# Altium project UZ_A_MAX11331.PrjPCB (part 1 of 3)
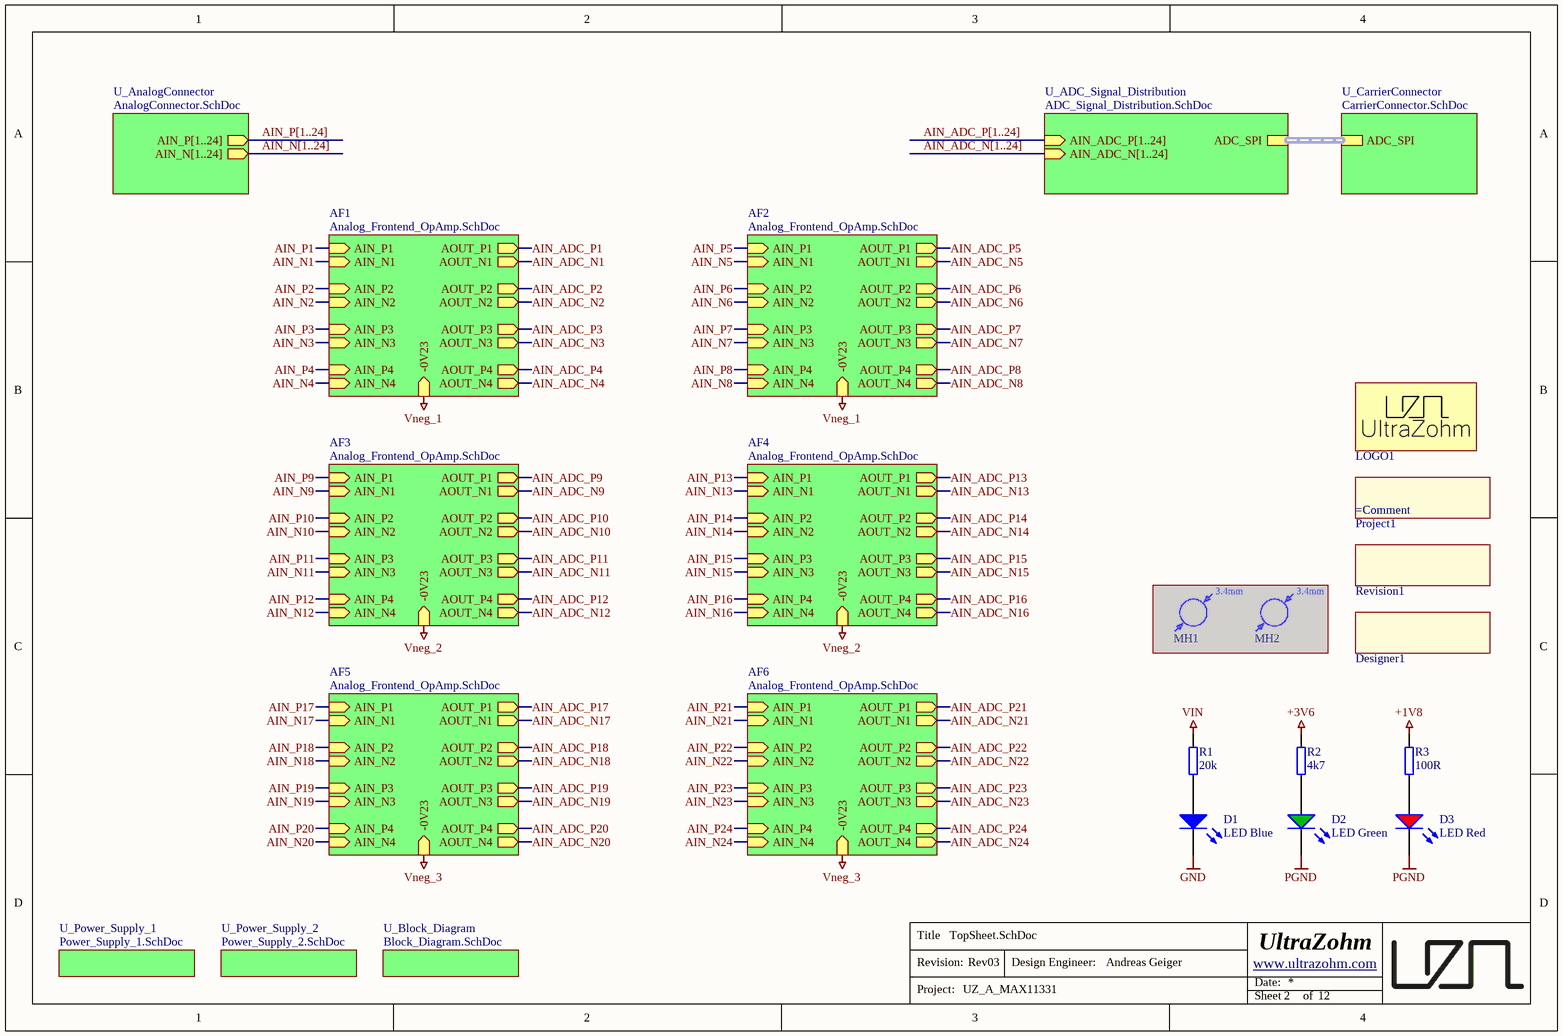
[diagram p0: TopSheet.SchDoc]
Author: Andreas Geiger; AuthorParam: Andreas Geiger; Date: 10/2025; ProjectName: UZ_A_MAX11331; ProjectNameCustom: =ProjectName; ProjectRevision: Rev03
12 sheets, 866 parts. Net scope: hierarchical (ports join the sheet entries above them; power ports are global).
Board file: UZ_A_MAX11331.PcbDoc
Sheets:
  TopSheet.SchDoc
    U_CarrierConnector = CarrierConnector.SchDoc
    U_AnalogConnector = AnalogConnector.SchDoc
    AF1 = Analog_Frontend_OpAmp.SchDoc
      BOA1 = BufferOpAmp.SchDoc
      BOA2 = BufferOpAmp.SchDoc
      BOA3 = BufferOpAmp.SchDoc
      BOA4 = BufferOpAmp.SchDoc
      CDMF1 = CM_DM_Filter.SchDoc
      CDMF2 = CM_DM_Filter.SchDoc
      CDMF3 = CM_DM_Filter.SchDoc
      CDMF4 = CM_DM_Filter.SchDoc
    U_Block_Diagram = Block_Diagram.SchDoc
    U_Power_Supply_1 = Power_Supply_1.SchDoc
    U_ADC_Signal_Distribution = ADC_Signal_Distribution.SchDoc
      ADC1 = Multiplexed_ADC.SchDoc
      ADC2 = Multiplexed_ADC.SchDoc
      ADC3 = Multiplexed_ADC.SchDoc
    AF2 = Analog_Frontend_OpAmp.SchDoc
      BOA1 = BufferOpAmp.SchDoc
      BOA2 = BufferOpAmp.SchDoc
      BOA3 = BufferOpAmp.SchDoc
      BOA4 = BufferOpAmp.SchDoc
      CDMF1 = CM_DM_Filter.SchDoc
      CDMF2 = CM_DM_Filter.SchDoc
      CDMF3 = CM_DM_Filter.SchDoc
      CDMF4 = CM_DM_Filter.SchDoc
    AF3 = Analog_Frontend_OpAmp.SchDoc
      BOA1 = BufferOpAmp.SchDoc
      BOA2 = BufferOpAmp.SchDoc
      BOA3 = BufferOpAmp.SchDoc
      BOA4 = BufferOpAmp.SchDoc
      CDMF1 = CM_DM_Filter.SchDoc
      CDMF2 = CM_DM_Filter.SchDoc
      CDMF3 = CM_DM_Filter.SchDoc
      CDMF4 = CM_DM_Filter.SchDoc
    AF4 = Analog_Frontend_OpAmp.SchDoc
      BOA1 = BufferOpAmp.SchDoc
      BOA2 = BufferOpAmp.SchDoc
      BOA3 = BufferOpAmp.SchDoc
      BOA4 = BufferOpAmp.SchDoc
      CDMF1 = CM_DM_Filter.SchDoc
      CDMF2 = CM_DM_Filter.SchDoc
      CDMF3 = CM_DM_Filter.SchDoc
      CDMF4 = CM_DM_Filter.SchDoc
    AF5 = Analog_Frontend_OpAmp.SchDoc
      BOA1 = BufferOpAmp.SchDoc
      BOA2 = BufferOpAmp.SchDoc
      BOA3 = BufferOpAmp.SchDoc
      BOA4 = BufferOpAmp.SchDoc
      CDMF1 = CM_DM_Filter.SchDoc
      CDMF2 = CM_DM_Filter.SchDoc
      CDMF3 = CM_DM_Filter.SchDoc
      CDMF4 = CM_DM_Filter.SchDoc
    AF6 = Analog_Frontend_OpAmp.SchDoc
      BOA1 = BufferOpAmp.SchDoc
      BOA2 = BufferOpAmp.SchDoc
      BOA3 = BufferOpAmp.SchDoc
      BOA4 = BufferOpAmp.SchDoc
      CDMF1 = CM_DM_Filter.SchDoc
      CDMF2 = CM_DM_Filter.SchDoc
      CDMF3 = CM_DM_Filter.SchDoc
      CDMF4 = CM_DM_Filter.SchDoc
    U_Power_Supply_2 = Power_Supply_2.SchDoc
      Vneg_1 = Power_Supply_3.SchDoc
      Vneg_2 = Power_Supply_3.SchDoc
      Vneg_3 = Power_Supply_3.SchDoc

## Sheet TopSheet.SchDoc
size A4; Author: Andreas Geiger; CompanyName: Technische Hochschule Nürnberg Georg Simon Ohm; Organization: UltraZohm; Address1: Kesslerplatz 12; Address2: 90489 Nürnberg; Address3: GERMANY; DocumentNumber: 2; SheetNumber: 2; SheetTotal: 12; Website: www.ultrazohm.com

### Parts
D1  LED Blue  [WL-SMCW_0603]
D2  LED Green  [WL-SMCW_0603]
D3  LED Red  [WL-SMCW_0603]
Designer1  (no value)  [Designator:comment]  (no BOM)
LOGO1  UZ Logo  [UZ_Logo_small]  (value not drawn)  (no BOM)
MH1  mounting hole 3,4mm  [MH_3.4]  (value not drawn)  (masked out: inside a compile mask, not in the netlist)
MH2  mounting hole 3,4mm  [MH_3.4]  (value not drawn)  (masked out: inside a compile mask, not in the netlist)
Project1  (no value)  [COMMENT]  (no BOM)
R1  20k  [RES 0603_1608]
R2  4k7  [R_0603_TE]
R3  100R  [RES 0603_1608]
Revision1  (no value)  [Designator:comment]  (no BOM)

### Sub-sheets
AF1 = Analog_Frontend_OpAmp.SchDoc: AIN_P1 (in), AIN_N1 (in), AOUT_P1 (out), AOUT_N1 (out), AIN_P2 (in), AIN_N2 (in), AIN_P3 (in), AIN_N3 (in), AIN_P4 (in), AIN_N4 (in), AOUT_P2 (out), AOUT_N2 (out), AOUT_P3 (out), AOUT_N3 (out), AOUT_P4 (out), AOUT_N4 (out), -0V23 (in)
AF2 = Analog_Frontend_OpAmp.SchDoc: AIN_P1 (in), AIN_N1 (in), AOUT_P1 (out), AOUT_N1 (out), AIN_P2 (in), AIN_N2 (in), AIN_P3 (in), AIN_N3 (in), AIN_P4 (in), AIN_N4 (in), AOUT_P2 (out), AOUT_N2 (out), AOUT_P3 (out), AOUT_N3 (out), AOUT_P4 (out), AOUT_N4 (out), -0V23 (in)
AF3 = Analog_Frontend_OpAmp.SchDoc: AIN_P1 (in), AIN_N1 (in), AOUT_P1 (out), AOUT_N1 (out), AIN_P2 (in), AIN_N2 (in), AIN_P3 (in), AIN_N3 (in), AIN_P4 (in), AIN_N4 (in), AOUT_P2 (out), AOUT_N2 (out), AOUT_P3 (out), AOUT_N3 (out), AOUT_P4 (out), AOUT_N4 (out), -0V23 (in)
AF4 = Analog_Frontend_OpAmp.SchDoc: AIN_P1 (in), AIN_N1 (in), AOUT_P1 (out), AOUT_N1 (out), AIN_P2 (in), AIN_N2 (in), AIN_P3 (in), AIN_N3 (in), AIN_P4 (in), AIN_N4 (in), AOUT_P2 (out), AOUT_N2 (out), AOUT_P3 (out), AOUT_N3 (out), AOUT_P4 (out), AOUT_N4 (out), -0V23 (in)
AF5 = Analog_Frontend_OpAmp.SchDoc: AIN_P1 (in), AIN_N1 (in), AOUT_P1 (out), AOUT_N1 (out), AIN_P2 (in), AIN_N2 (in), AIN_P3 (in), AIN_N3 (in), AIN_P4 (in), AIN_N4 (in), AOUT_P2 (out), AOUT_N2 (out), AOUT_P3 (out), AOUT_N3 (out), AOUT_P4 (out), AOUT_N4 (out), -0V23 (in)
AF6 = Analog_Frontend_OpAmp.SchDoc: AIN_P1 (in), AIN_N1 (in), AOUT_P1 (out), AOUT_N1 (out), AIN_P2 (in), AIN_N2 (in), AIN_P3 (in), AIN_N3 (in), AIN_P4 (in), AIN_N4 (in), AOUT_P2 (out), AOUT_N2 (out), AOUT_P3 (out), AOUT_N3 (out), AOUT_P4 (out), AOUT_N4 (out), -0V23 (in)
U_ADC_Signal_Distribution = ADC_Signal_Distribution.SchDoc: AIN_ADC_P[1..24] (in), AIN_ADC_N[1..24] (in), ADC_SPI (harness ADC_SPI)
U_AnalogConnector = AnalogConnector.SchDoc: AIN_P[1..24] (out), AIN_N[1..24] (out)
U_Block_Diagram = Block_Diagram.SchDoc: no entries
U_CarrierConnector = CarrierConnector.SchDoc: ADC_SPI (harness ADC_SPI)
U_Power_Supply_1 = Power_Supply_1.SchDoc: no entries
U_Power_Supply_2 = Power_Supply_2.SchDoc: no entries

### Nets
+1V8: R3.2
+3V6: R2.2
GND: D1.1(K)
PGND: D2.1(K) D3.1(K)
VIN: R1.2
Vneg_1: sheet AF1/-0V23, sheet AF2/-0V23
Vneg_2: sheet AF3/-0V23, sheet AF4/-0V23
Vneg_3: sheet AF5/-0V23, sheet AF6/-0V23
NetD1_2: D1.2(A) R1.1
NetD2_2: D2.2(A) R2.1
NetD3_2: D3.2(A) R3.1

### Buses and harness runs
bus AIN_ADC_N[1..24] = sheet U_ADC_Signal_Distribution/AIN_ADC_N[1..24]
bus AIN_ADC_P[1..24] = sheet U_ADC_Signal_Distribution/AIN_ADC_P[1..24]
bus AIN_N[1..24] = sheet U_AnalogConnector/AIN_N[1..24]
bus AIN_P[1..24] = sheet U_AnalogConnector/AIN_P[1..24]
harness sheet U_ADC_Signal_Distribution/ADC_SPI = sheet U_CarrierConnector/ADC_SPI

### Notes on the sheet
- Title
- Revision:
- Design Engineer:
- Date:
- Project:
- Sheet
- of
- (in symbol Mounting Hole) 3.4mm

### Library data of the parts
D1 = 19-217/BHC-ZL1M2RY/3T: LED BLUE 465~475NM 11.5~28.5MCD@5MA TOP VIEW 0603 ROHS; Manufacturer: Everlight Elec; Type: Standard; Created from: T. Wendt; Forward Current I_f: 20 mA; Forward Voltage U_f: 2.8 V; Wavelength: 470 nm; Nominal Power: 68 mW; Manufacturer Part Number: 19-217/BHC-ZL1M2RY/3T; PartID: 6; Created On: 03.03.2021 09:59:51; ComponentLink1Description: Datasheet; ComponentLink1URL: https://datasheet.lcsc.com/szlcsc/Everlight-Elec-19-217-BHC-ZL1M2RY-3T_C72041.pdf; Component Type: LED Diode; Device Package: 0603; Last Updated: 04.03.2021 09:02:49; Mounting Type: SMD; Operating Temperature: -40 - 85 °C; Supplier 1: LCSC; Supplier Part Number 1: C72041; Live Cycle Status: 1; Stock number: not stored; Color: blue; Light Intensity: 28.5 mcd; LCSC Part Number: C72041
D2 = 19-217/GHC-YR1S2/3T: LED GREEN 520~535NM 112~258MCD@20MA TOP VIEW 0603 ROHS; Manufacturer: Everlight Elec; Type: Standard; Created from: T. Wendt; Forward Current I_f: 20 mA; Forward Voltage U_f: 3.3 V; Wavelength: 530 nm; Light Intensity: 285 mcd; Nominal Power: 83 mW; Manufacturer Part Number: 19-217/GHC-YR1S2/3T; PartID: 7; Created On: 03.03.2021 10:06:23; ComponentLink1Description: Datasheet; ComponentLink1URL: https://datasheet.lcsc.com/szlcsc/Everlight-Elec-19-217-GHC-YR1S2-3T_C72043.pdf; Component Type: LED Diode; Device Package: 0603; Last Updated: 04.03.2021 09:02:49; Mounting Type: SMD; Operating Temperature: -40 - 85 °C; Supplier 1: LCSC; Supplier Part Number 1: C72043; Supplier 2: Mouser; Supplier Part Number 2: 638-19217GHCYR1S23T; Live Cycle Status: 1; Stock number: not stored; Color: green; LCSC Part Number: C72043
D3 = KT-0603R: LED RED 520~625NM 90~100MCD@20MA TOP VIEW 0603 ROHS; Manufacturer: Hubei KENTO Elec; Type: Standard; Created from: T. Wendt; Forward Current I_f: 20 mA; Forward Voltage U_f: 2.1 V; Wavelength: 620 nm; Light Intensity: 110 mcd; Nominal Power: 42 mW; Manufacturer Part Number: KT-0603R; PartID: 8; Created On: 03.03.2021 10:06:23; ComponentLink1Description: Datasheet; ComponentLink1URL: https://datasheet.lcsc.com/szlcsc/Hubei-KENTO-Elec-KT-0603R_C2286.pdf; Component Type: LED Diode; Device Package: 0603; Last Updated: 04.03.2021 09:02:49; Mounting Type: SMD; Operating Temperature: -40 - 85 °C; Supplier 1: LCSC; Supplier Part Number 1: C2286; Live Cycle Status: 1; Stock number: not stored; Color: red; LCSC Part Number: C2286
Designer1 = 4: Create a project parameter named "Author" this is the value of this component. It is printed on the PCB. Once the parameter is updated (e.g. new revision) it gets updated on the PCB as well; Manufacturer: PCB Manufacturer; Manufacturer Part Number: Project Author; Value: Andreas Geiger; Created from: T. Wendt; PartID: 4; Created On: 01.03.2021 08:53:41; Component Type: Project Author; Last Updated: 01.03.2021 09:20:27; Type: Standard (No BOM); Live Cycle Status: 1
LOGO1 = 1: Official Project Logo of the UltraZohm; Manufacturer: PCB Manufacturer; Manufacturer Part Number: UltraZohm Logo; Created from: T. Wendt; PartID: 1; Created On: 19.02.2021 16:55:56; ComponentLink1Description: Homepage; ComponentLink1URL: https://ultrazohm.com; Component Type: Logo; Last Updated: 02.03.2021 14:31:24; Type: Standard (No BOM); Live Cycle Status: 1
MH1 MH2 = Mounting Hole: Non plated through hole, 3.4mm
Project1 = 2: Create a project parameter named "ProjectNameCustom" this is the value of this component and it is printed on the PCB.; Manufacturer: PCB Manufacturer; Created from: T. Wendt; PartID: 2; Created On: 01.03.2021 08:43:57; Component Type: Project Name; Last Updated: 01.03.2021 09:07:27; Manufacturer Part Number: Project Name; Type: Standard (No BOM); Value: =ProjectName; Live Cycle Status: 1
R1 = 0603WAF2002T5E: SMD resistor E24 series; Manufacturer: UNI-ROYAL; Tolerance: 1%; Created from: AGeiger; Manufacturer Part Number: 0603WAF2002T5E; PartID: 105; Created On: 14.12.2020 16:17:14; ComponentLink1Description: Datasheet; ComponentLink1URL: https://datasheet.lcsc.com/lcsc/2206010230_UNI-ROYAL-Uniroyal-Elec-0603WAF2002T5E_C4184.pdf; Component Type: SMD resistor; Device Package: 0603; Last Updated: 25.08.2022 20:05:50; Mounting Type: SMD; Supplier 1: LCSC; Supplier Part Number 1: C4184; Type: Resistor; Value: 20k; Live Cycle Status: 1; Stock number: Labor SMD Container; LCSC Part Number: C4184
R2 = UZgen_R_0603_4k7: Generic resistor; Manufacturer: UZgen; Tolerance: 1 %; Created from: UZgenTool; Manufacturer Part Number: UZgen_R_0603_4k7; PartID: 237; Created On: 02.07.2024 17:29:50; Device Package: 0603; Last Updated: 02.07.2024 17:29:50; Mounting Type: SMD; Value: 4k7
R3 = RK73B1JTTD101J: SMD resistor E24 series; Manufacturer: KOA Speer; Tolerance: 5%; Created from: MGremer; Manufacturer Part Number: RK73B1JTTD101J; PartID: 50; Created On: 14.12.2020 16:17:14; ComponentLink1Description: Datasheet; ComponentLink1URL: https://www.mouser.de/datasheet/2/219/RK73B-1825463.pdf; Component Type: SMD resistor; Device Package: 0603; Last Updated: 29.11.2022 14:30:07; Mounting Type: SMD; Supplier 1: Mouser; Supplier Part Number 1: 660-RK73B1JTTD101J; Type: Resistor; Value: 100R; Live Cycle Status: 1; Stock number: Labor SMD Container; LCSC Part Number: C22775; Supplier 2: LCSC; Supplier Part Number 2: C22775
Revision1 = 3: Create a project parameter named "ProjectRevision" this is the value of this component. It is printed on the PCB. Once the parameter is updated (e.g. new revision) it gets updated on the PCB as well; Manufacturer: PCB Manufacturer; Value: Rev03; Created from: T. Wendt; PartID: 3; Created On: 01.03.2021 08:50:34; Component Type: Project Revision; Last Updated: 01.03.2021 09:28:36; Manufacturer Part Number: Project Revision; Type: Standard (No BOM); Live Cycle Status: 1

## Sheet CarrierConnector.SchDoc
size A4; Author: Andreas Geiger; CompanyName: Technische Hochschule Nürnberg Georg Simon Ohm; Organization: UltraZohm; Address1: Kesslerplatz 12; Address2: 90489 Nürnberg; Address3: GERMANY; DocumentNumber: 3; SheetNumber: 3; SheetTotal: 12; Website: www.ultrazohm.com
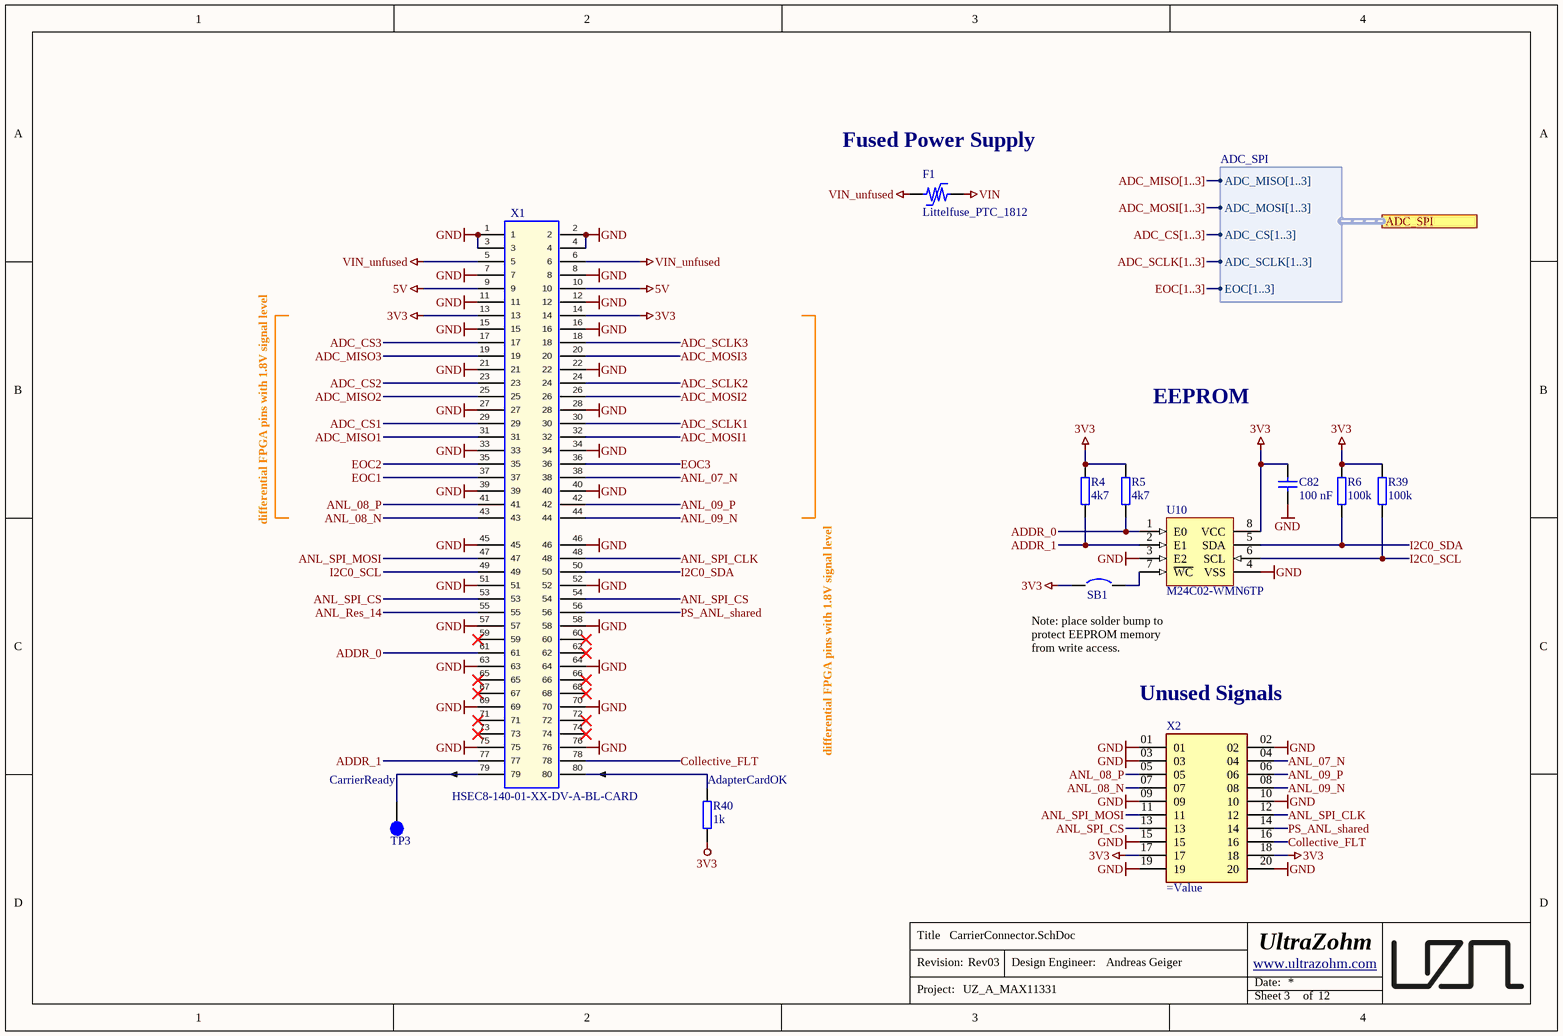
[diagram p1: CarrierConnector.SchDoc]

### Parts
C82  100 nF  [C_0603_TE]
F1  Littelfuse_PTC_1812  [1812_PTC_Polyfuse_Littelfuse]
R4  4k7  [R_0603_TE]
R5  4k7  [R_0603_TE]
R6  100k  [R_0603_TE]
R39  100k  [R_0603_TE]
R40  1k  [R_0603_TE]
SB1  Solder Bump 0603  [SB_0603]  (value not drawn)  (no BOM)
TP3  Testpoint 1mm  [TP_1mm]  (value not drawn)  (no BOM)
U10  M24C02-WMN6TP  [D0008A_N]
X1  HSEC8-140-01-XX-DV-A-BL-CARD  [HSEC8-140-01-XX-DV-A-BL-CARD]  (no BOM)
X2  (no value)  [SAMTEC_FTSH-110-X-X-DV]

### Ports
ADC_SPI (harness ADC_SPI)

### Harnesses
ADC_SPI: ADC_MISO[1..3], ADC_MOSI[1..3], ADC_CS[1..3], ADC_SCLK[1..3], EOC[1..3]

### Nets
3V3: C82.1 R4.2 R5.2 R6.2 R39.2 R40.1 SB1.1 U10.8(VCC) X1.13 X1.14 X2.17 X2.18
5V: X1.9 X1.10
GND: C82.2 U10.3(E2) U10.4(VSS) X1.1 X1.2 X1.3 X1.4 X1.7 X1.8 X1.11 X1.12 X1.15 X1.16 X1.21 X1.22 X1.27 X1.28 X1.33 X1.34 X1.39 X1.40 X1.45 X1.46 X1.51 X1.52 X1.57 X1.58 X1.63 X1.64 X1.69 X1.70 X1.75 X1.76 X2.01 X2.02 X2.03 X2.09 X2.10 X2.15 X2.19 X2.20
VIN: F1.2
VIN_unfused: F1.1 X1.5 X1.6
ADC_CS1: X1.29
ADC_CS2: X1.23
ADC_CS3: X1.17
ADC_MISO1: X1.31
ADC_MISO2: X1.25
ADC_MISO3: X1.19
ADC_MOSI1: X1.32
ADC_MOSI2: X1.26
ADC_MOSI3: X1.20
ADC_SCLK1: X1.30
ADC_SCLK2: X1.24
ADC_SCLK3: X1.18
ADDR_0: R5.1 U10.1(E0) X1.61
ADDR_1: R4.1 U10.2(E1) X1.77
ANL_07_N: X1.38 X2.04
ANL_08_N: X1.43 X2.07
ANL_08_P: X1.41 X2.05
ANL_09_N: X1.44 X2.08
ANL_09_P: X1.42 X2.06
ANL_Res_14: X1.55
ANL_SPI_CLK: X1.48 X2.12
ANL_SPI_CS: X1.53 X1.54 X2.13
ANL_SPI_MOSI: X1.47 X2.11
Collective_FLT: X1.78 X2.16
EOC1: X1.37
EOC2: X1.35
EOC3: X1.36
I2C0_SCL: R39.1 U10.6(SCL) X1.49
I2C0_SDA: R6.1 U10.5(SDA) X1.50
PS_ANL_shared: X1.56 X2.14
NetR40_2: R40.2 X1.80
NetSB1_2: SB1.2 U10.7(~{WC})
NetTP3_1: TP3.1 X1.79

Not connected (* = marked no-connect by the designer): X1 59* 60* 62* 65* 66* 67* 68* 71* 72* 73* 74*

### Buses and harness runs
bus ADC_CS[1..3]
bus ADC_MISO[1..3]
bus ADC_MOSI[1..3]
bus ADC_SCLK[1..3]
bus EOC[1..3]

### Notes on the sheet
- (near F1) Fused Power Supply
- EEPROM
- differential FPGA pins with 1.8V signal level
- Note: place solder bump to protect EEPROM memory from write access.
- (near X2) Unused Signals
- (near TP3) CarrierReady
- (near R40) AdapterCardOK
- Title
- Revision:
- Design Engineer:
- Date:
- Project:
- Sheet
- of

### Library data of the parts
C82 = UZgen_C_0603_100nF_50V_X7R: Generic capacitor; Manufacturer: UZgen; Tolerance: 10 %; Created from: AGeiger; Voltage: 50V; Manufacturer Part Number: UZgen_C_0603_100nF_50V_X7R; PartID: 1; Created On: 02.07.2024 14:42:23; Device Package: 0603; Last Updated: 08.08.2024 15:01:15; Mounting Type: SMD; Value: 100 nF; Technology: X7R
F1 = Littelfuse_PTC_1812: POLYSWITCH RESETTABLE DEVICES; MPN: miniASMDC110F/24; Value: PTC, 1.1 A, 24V; Voltage: 24V; Trip Current: 2.2A; Hold Current: 1.1A; Resistance: 0.18 Ohm; Type: Fuse; Nominal current: 1 A; Created from: MHlatky; MF: Littelfuse; Created: 2019_02_10_AGeiger; Package: 1812; ComponentLink1URL: https://www.littelfuse.com/~/media/electronics/datasheets/resettable_ptcs/littelfuse_ptc_surface_mount_catalog_datasheet.pdf.pdf; ComponentLink1Description: Datasheet; Manufacturer Part Number: Littelfuse_PTC_1812; PartID: 5; Created On: 07.05.2021 06:50:33; Component Type: Littelfuse_PTC_1812; Last Updated: 27.05.2022 15:06:17; Manufacturer: Littelfuse; Mounting Type: SMD; Operating Temperature: -40 - 85 °C; Supplier 1: Mouser; Supplier Part Number 1: 530-0ZCG0150BF2C; Live Cycle Status: 1; LCSC Part Number: C70119
R4 R5 = UZgen_R_0603_4k7: as R2 on sheet TopSheet; Manufacturer Part Number: UZgen_R_0603_4k7; PartID: 237; Created On: 02.07.2024 17:29:50; Device Package: 0603; Last Updated: 02.07.2024 17:29:50; Mounting Type: SMD; Value: 4k7
R6 R39 = UZgen_R_0603_100k: Generic resistor; Manufacturer: UZgen; Tolerance: 1 %; Created from: UZgenTool; Manufacturer Part Number: UZgen_R_0603_100k; PartID: 268; Created On: 02.07.2024 17:29:50; Device Package: 0603; Last Updated: 02.07.2024 17:29:50; Mounting Type: SMD; Value: 100k
R40 = UZgen_R_0603_1k: Generic resistor; Manufacturer: UZgen; Tolerance: 1 %; Created from: UZgenTool; Manufacturer Part Number: UZgen_R_0603_1k; PartID: 221; Created On: 02.07.2024 17:29:49; Value: 1k; Device Package: 0603; Mounting Type: SMD; Last Updated: 02.07.2024 17:29:49
SB1 = =Value: Created from: AGeiger; Revision: July-2002: Re-released for DXP Platform.; PartID: 1; Created On: 09.01.2024 17:13:56; Component Type: Solder Bump; Device Package: 0603; Last Updated: 09.01.2024 17:13:56; Manufacturer Part Number: Solder Bump 0603; Mounting Type: SMD; Value: Solder Bump 0603
TP3 = Testpoint_1mm: Manufacturer: UltraZohm; Created from: AGeiger; Created: 2018_06_25_AGeiger; Value: Testpoint 1mm; Manufacturer Part Number: Testpoint_1mm; PartID: 9; Created On: 20.09.2022 13:14:57; Component Type: Testpoint; Last Updated: 14.08.2025 11:47:07; Supplier 1: NULL; Supplier Part Number 1: NULL; Type: Testpoint; Live Cycle Status: 1
U10 = M24C02-WMN6TP: 2Kbit I2C SOP-8 EEPROM ROHS; Manufacturer: STMicroelectronics; Created from: AGeiger; Manufacturer Part Number: M24C02-WMN6TP; PartID: 1; Created On: 19.11.2023 14:54:27; ComponentLink1Description: Datasheet; ComponentLink1URL: https://www.st.com/resource/en/datasheet/m24c01-w.pdf; Component Type: EEPROM; Device Package: SOIC-8; Last Updated: 19.11.2023 21:39:04; Mounting Type: SMD; Operating Temperature: -40 to +85 °C; Series: M24xxx; Supplier 1: Mouser; Supplier Part Number 1: 511-M24C02-WMN6TP; Supplier 2: LCSC; Supplier Part Number 2: C7562; Type: Memory; Value: M24C02-WMN6TP; LCSC Part Number: C7562; MF: STMicroelectronics; MPN: M24C02-WMN6TP
X1 = HSEC8-140-01-XX-DV-A-BL-CARD: Mating Card Layout for HSEC8-140-01-XX-DV-A-BL-CARD; Manufacturer: SAMTEC; Created from: MHlatky; Number of positions: 100; Created: 2018_04_23_AGeiger; Value: HSEC8-140-01-XX-DV-A-BL-CARD; Manufacturer Part Number: HSEC8-140-01-XX-DV-A-BL-CARD; PartID: 21; Created On: 26.02.2021 16:36:12; ComponentLink1Description: Homepage; ComponentLink1URL: https://www.samtec.com/products/hsec8-dp; Component Type: Board to Board Connector; Device Package: PCB Shape; Last Updated: 26.02.2021 16:37:20; Mounting Type: PCB Shape; Series: HSEC8; Supplier 1: SAMTEC; Supplier Part Number 1: NA; Type: Board to Board Connector; Live Cycle Status: 1; Stock number: not stored; Number of rows: 2
X2 = FTSH-110-01-L-DV: Headers & Wire Housings High Reliability Header Strips, 0.050 pitch; Manufacturer: SAMTEC; Created from: AGeiger; Price: None; Value: FTSH-110-01-L-DV; Availability: Unavailable; Package: None; MP: FTSH-110-X-X-DV; PartID: 1; Created On: 29.09.2022 16:58:28; ComponentLink1Description: Datasheet; ComponentLink1URL: https://eu.mouser.com/datasheet/2/527/ftsh_th-2854322.pdf; Last Updated: 29.09.2022 16:58:28; Manufacturer Part Number: FTSH-110-01-L-DV; Mounting Type: SMD; Operating Temperature: -55 °C to +125 °C; Series: FTSH; Supplier 1: Mouser; Supplier Part Number 1: 200-FTSH11001LDV

## Sheet AnalogConnector.SchDoc
size A4; Author: Andreas Geiger; CompanyName: Technische Hochschule Nürnberg Georg Simon Ohm; Organization: UltraZohm; Address1: Kesslerplatz 12; Address2: 90489 Nürnberg; Address3: GERMANY; DocumentNumber: 4; SheetNumber: 4; SheetTotal: 12; Website: www.ultrazohm.com
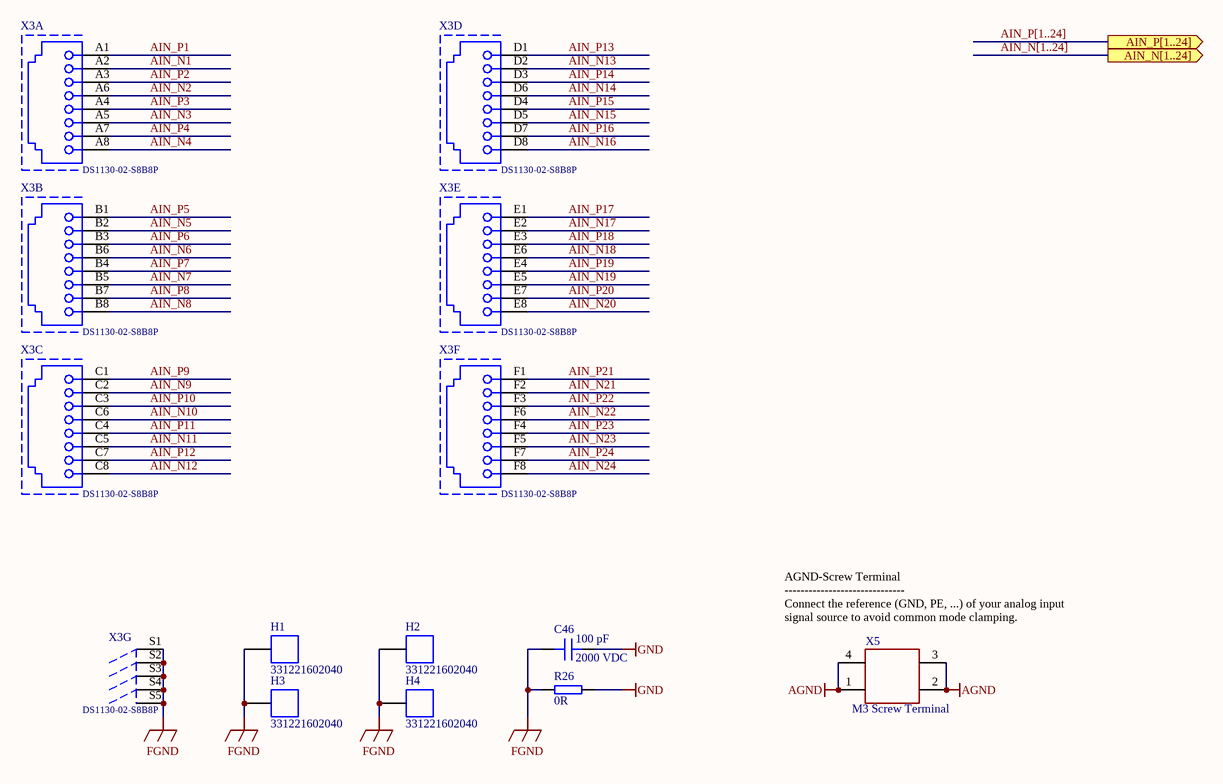
[diagram p2: AnalogConnector.SchDoc]

### Parts
C46  100 pF  Voltage Rating: 2000 VDC  [C_1206]
H1  331221602040  [331221602040]
H2  331221602040  [331221602040]
H3  331221602040  [331221602040]
H4  331221602040  [331221602040]
R26  0R  [R_1206_TE]
X3  DS1130-02-S8B8P  [DS1130-02-S8B8P]  (parts A,B,C,D,E,F,G of 7)
X5  M3 Screw Terminal  [KEYSTONE_7698]

### Ports
AIN_N[1..24] (out), AIN_P[1..24] (out)

### Nets
AGND: X5.1 X5.2 X5.3 X5.4
FGND: C46.1 H1.1 H2.1 H3.1 H4.1 R26.1 X3.S1 X3.S2 X3.S3 X3.S4 X3.S5
GND: C46.2 R26.2
AIN_N1: X3.A2
AIN_N2: X3.A6
AIN_N3: X3.A5
AIN_N4: X3.A8
AIN_N5: X3.B2
AIN_N6: X3.B6
AIN_N7: X3.B5
AIN_N8: X3.B8
AIN_N9: X3.C2
AIN_N10: X3.C6
AIN_N11: X3.C5
AIN_N12: X3.C8
AIN_N13: X3.D2
AIN_N14: X3.D6
AIN_N15: X3.D5
AIN_N16: X3.D8
AIN_N17: X3.E2
AIN_N18: X3.E6
AIN_N19: X3.E5
AIN_N20: X3.E8
AIN_N21: X3.F2
AIN_N22: X3.F6
AIN_N23: X3.F5
AIN_N24: X3.F8
AIN_P1: X3.A1
AIN_P2: X3.A3
AIN_P3: X3.A4
AIN_P4: X3.A7
AIN_P5: X3.B1
AIN_P6: X3.B3
AIN_P7: X3.B4
AIN_P8: X3.B7
AIN_P9: X3.C1
AIN_P10: X3.C3
AIN_P11: X3.C4
AIN_P12: X3.C7
AIN_P13: X3.D1
AIN_P14: X3.D3
AIN_P15: X3.D4
AIN_P16: X3.D7
AIN_P17: X3.E1
AIN_P18: X3.E3
AIN_P19: X3.E4
AIN_P20: X3.E7
AIN_P21: X3.F1
AIN_P22: X3.F3
AIN_P23: X3.F4
AIN_P24: X3.F7

### Buses and harness runs
bus AIN_N[1..24] = port AIN_N[1..24]
bus AIN_P[1..24] = port AIN_P[1..24]

### Notes on the sheet
- (near X5) AGND-Screw Terminal
  ------------------------------
  Connect the reference (GND, PE, ...) of your analog input signal source to avoid common mode clamping.
- Title
- Revision:
- Design Engineer:
- Date:
- Project:
- Sheet
- of

### Library data of the parts
C46 = CC1206JKNPODBN101: 2kV 100pF NP0 ±5% 1206 Multilayer Ceramic Capacitors MLCC - SMD/SMT ROHS; Manufacturer: YAGEO; Created from: AGeiger; Manufacturer Part Number: CC1206JKNPODBN101; PartID: 115; Created On: 02.12.2022 11:59:53; ComponentLink1Description: Datasheet; ComponentLink1URL: https://datasheet.lcsc.com/lcsc/2108131530_YAGEO-CC1206JKNPODBN101_C113876.pdf; Component Type: Capacitor 1206; Device Package: 1206; Last Updated: 02.12.2022 11:59:53; Mounting Type: SMD; Operating Temperature: -55 to +125°C; Series: NP0; Supplier 1: LCSC; Supplier Part Number 1: C113876; Type: Capacitor; Tolerance: 5 %; Value: 100 pF; Live Cycle Status: 1; LCSC Part Number: C113876
H1-H4 = 331221602040: Contact Finger between PCB's earth and housing; Manufacturer: Wuerth Elektronik; Match Code: WE-SECF; Recommended Working Height Min: 5mm; Recommended Working Height Max: 5.7mm; Created from: AGeiger; ComponentLink1Description: Datasheet; ComponentLink1URL: https://redexpert.we-online.com/redexpert/spec/331221602040.pdf; ComponentLink2Description: Datasheet Link; ComponentLink2URL: https://www.we-online.com/redexpert/spec/331221602040?ad; Manufacturer Part Number: 331221602040; Category: EMC Shielding; Mount: Surface Mount; Operating Temperature Max: 100°C; Operating Temperature Min: -40°C; Packaging: Tape and Reel; Length: 6mm; Width: 2mm; Height: 4mm; Material: Copper Beryllium (CuBe) gold-plated(AU); PartID: 18; Created On: 02.12.2022 10:27:54; Component Type: EMI Contact Finger; Last Updated: 02.12.2022 10:27:54; Mounting Type: SMD; Operating Temperature: -40 to +100 °C; Series: SECF; Supplier 1: Mouser; Supplier Part Number 1: 710-331221602040; Type: Contact Finger; Value: 331221602040; Live Cycle Status: 1
R26 = UZgen_R_1206_0R: Generic resistor; Manufacturer: UZgen; Tolerance: 1 %; Created from: UZgenTool; Manufacturer Part Number: UZgen_R_1206_0R; PartID: 583; Created On: 08.07.2024 14:34:30; Device Package: 1206; Last Updated: 08.07.2024 14:34:30; Mounting Type: SMD; Value: 0R
X3 = DS1130-02-S8B8P: RJ45 RJReceptacle 6 No Plugin Ethernet Connectors/Modular Connectors (RJ45 RJ11) ROHS; Manufacturer: CONNFLY Elec; Created from: AGeiger; Manufacturer Part Number: DS1130-02-S8B8P; PartID: 7; Created On: 20.09.2022 09:18:12; ComponentLink1Description: Datasheet; ComponentLink1URL: https://datasheet.lcsc.com/lcsc/1811141116_CONNFLY-Elec-DS1130-02-S8B8P_C86584.pdf; Component Type: RJ45 Connector; Device Package: RJ45; Last Updated: 20.09.2022 09:18:12; Mounting Type: THT; Supplier 1: LCSC; Supplier Part Number 1: C86584; Type: RJ45 Connector; Live Cycle Status: 1; LCSC Part Number: C86584; Stock number: not stored
X5 = Keystone: Tin 15A Brass 4 Through Hole M3x0.5 Screw Connectors ROHS; Created from: AGeiger; Manufacturer Part Number: Keystone; PartID: 5; Created On: 02.10.2025 12:53:47; ComponentLink1Description: Datasheet; ComponentLink1URL: https://www.mouser.de/datasheet/3/201/1/7698.PDF; Component Type: Metric Screw Terminal; Last Updated: 02.10.2025 13:02:36; Mounting Type: THT; Supplier 1: Mouser; Supplier Part Number 1: 534-7698; Supplier 2: LCSC; Supplier Part Number 2: C6708741; Value: M3 Screw Terminal; LCSC Part Number: C6708741

## Sheet Analog_Frontend_OpAmp.SchDoc
size A4; Author: Andreas Geiger; CompanyName: Technische Hochschule Nürnberg Georg Simon Ohm; Organization: UltraZohm; Address1: Kesslerplatz 12; Address2: 90489 Nürnberg; Address3: GERMANY; DocumentNumber: 5; SheetNumber: 5; SheetTotal: 12; Website: www.ultrazohm.com
Used 6 times, as channels AF1, AF2, AF3, AF4, AF5, AF6. Parts and nets are listed once, with the designators drawn on the sheet.
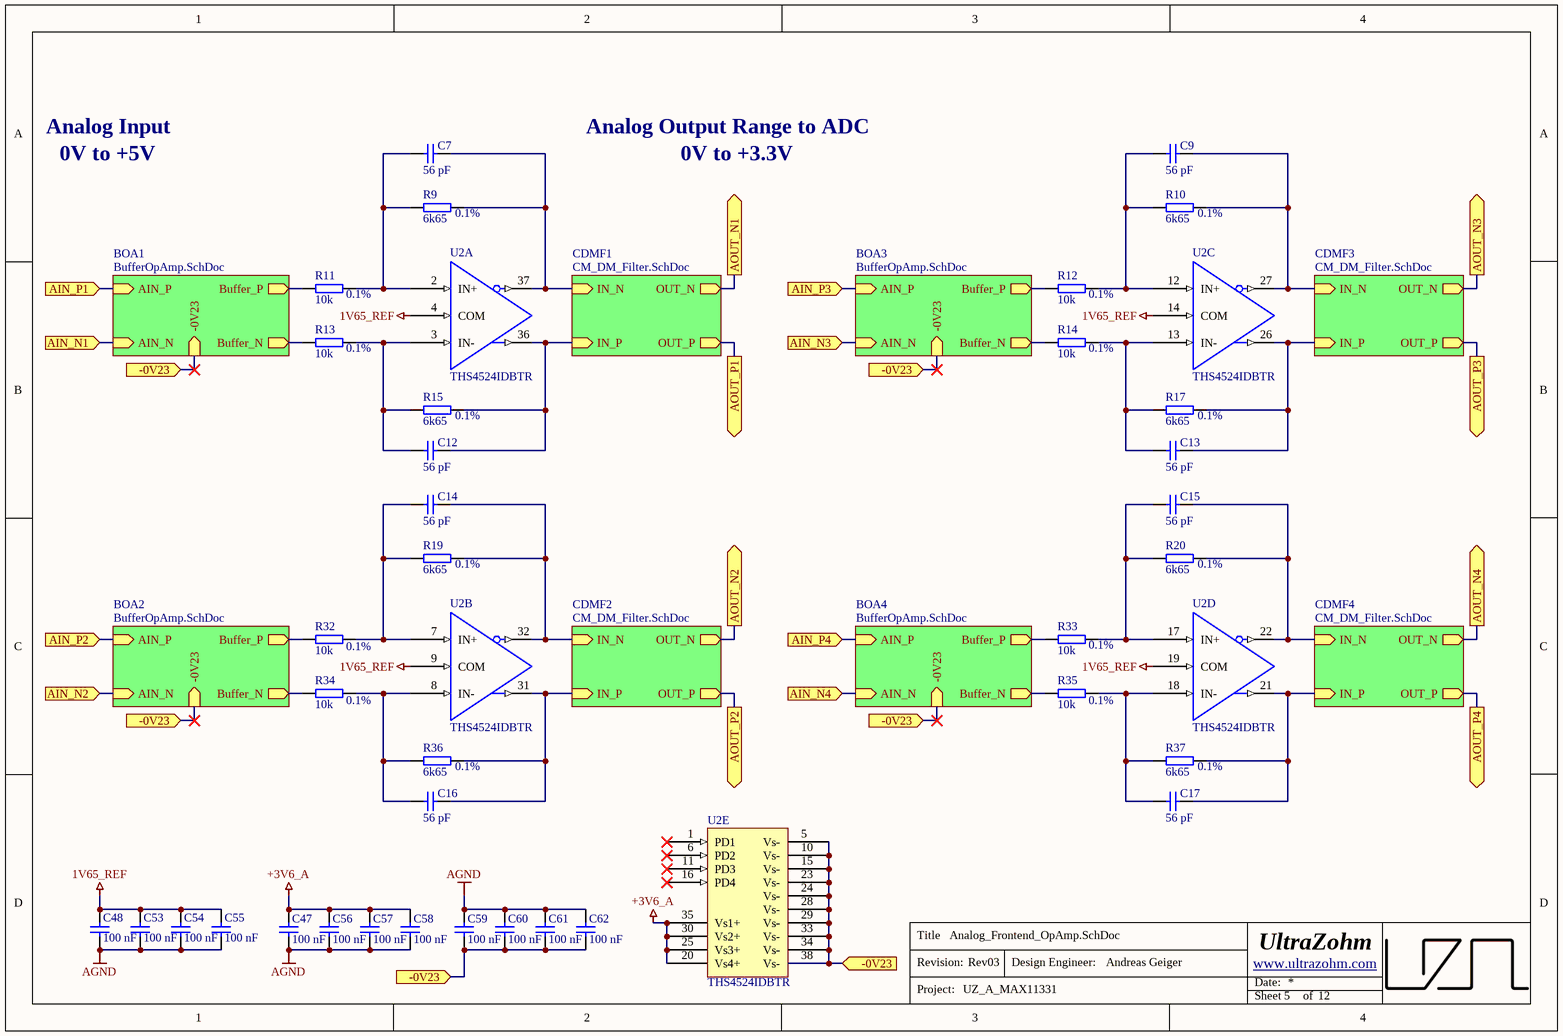
[diagram p3: Analog_Frontend_OpAmp.SchDoc]

### Parts
C7  56 pF  [C_0402_TE]
C9  56 pF  [C_0402_TE]
C12  56 pF  [C_0402_TE]
C13  56 pF  [C_0402_TE]
C14  56 pF  [C_0402_TE]
C15  56 pF  [C_0402_TE]
C16  56 pF  [C_0402_TE]
C17  56 pF  [C_0402_TE]
C47  100 nF  [C_0402_TE]
C48  100 nF  [C_0402_TE]
C53  100 nF  [C_0402_TE]
C54  100 nF  [C_0402_TE]
C55  100 nF  [C_0402_TE]
C56  100 nF  [C_0402_TE]
C57  100 nF  [C_0402_TE]
C58  100 nF  [C_0402_TE]
C59  100 nF  [C_0402_TE]
C60  100 nF  [C_0402_TE]
C61  100 nF  [C_0402_TE]
C62  100 nF  [C_0402_TE]
R9  6k65  Tolerance: 0.1%  [R_0402_TE]
R10  6k65  Tolerance: 0.1%  [R_0402_TE]
R11  10k  Tolerance: 0.1%  [R_0402_TE]
R12  10k  Tolerance: 0.1%  [R_0402_TE]
R13  10k  Tolerance: 0.1%  [R_0402_TE]
R14  10k  Tolerance: 0.1%  [R_0402_TE]
R15  6k65  Tolerance: 0.1%  [R_0402_TE]
R17  6k65  Tolerance: 0.1%  [R_0402_TE]
R19  6k65  Tolerance: 0.1%  [R_0402_TE]
R20  6k65  Tolerance: 0.1%  [R_0402_TE]
R32  10k  Tolerance: 0.1%  [R_0402_TE]
R33  10k  Tolerance: 0.1%  [R_0402_TE]
R34  10k  Tolerance: 0.1%  [R_0402_TE]
R35  10k  Tolerance: 0.1%  [R_0402_TE]
R36  6k65  Tolerance: 0.1%  [R_0402_TE]
R37  6k65  Tolerance: 0.1%  [R_0402_TE]
U2  THS4524IDBTR  [TSSOP-38]  (parts A,B,C,D,E of 5)

### Sub-sheets
BOA1 = BufferOpAmp.SchDoc: Buffer_P (out), Buffer_N (out), AIN_P (in), AIN_N (in), -0V23 (in)
BOA2 = BufferOpAmp.SchDoc: Buffer_P (out), Buffer_N (out), AIN_P (in), AIN_N (in), -0V23 (in)
BOA3 = BufferOpAmp.SchDoc: Buffer_P (out), Buffer_N (out), AIN_P (in), AIN_N (in), -0V23 (in)
BOA4 = BufferOpAmp.SchDoc: Buffer_P (out), Buffer_N (out), AIN_P (in), AIN_N (in), -0V23 (in)
CDMF1 = CM_DM_Filter.SchDoc: IN_P (in), IN_N (in), OUT_P (out), OUT_N (out)
CDMF2 = CM_DM_Filter.SchDoc: IN_P (in), IN_N (in), OUT_P (out), OUT_N (out)
CDMF3 = CM_DM_Filter.SchDoc: IN_P (in), IN_N (in), OUT_P (out), OUT_N (out)
CDMF4 = CM_DM_Filter.SchDoc: IN_P (in), IN_N (in), OUT_P (out), OUT_N (out)

### Ports
-0V23 (in), AIN_N1 (in), AIN_N2 (in), AIN_N3 (in), AIN_N4 (in), AIN_P1 (in), AIN_P2 (in), AIN_P3 (in), AIN_P4 (in), AOUT_N1 (out), AOUT_N2 (out), AOUT_N3 (out), AOUT_N4 (out), AOUT_P1 (out), AOUT_P2 (out), AOUT_P3 (out), AOUT_P4 (out)

### Nets
1V65_REF: C48.1 C53.1 C54.1 C55.1 U2.4(COM) U2.9(COM) U2.14(COM) U2.19(COM)
+3V6_A: C47.1 C56.1 C57.1 C58.1 U2.20(Vs4+) U2.25(Vs3+) U2.30(Vs2+) U2.35(Vs1+)
AGND: C47.2 C48.2 C53.2 C54.2 C55.2 C56.2 C57.2 C58.2 C59.1 C60.1 C61.1 C62.1
-0V23: C59.2 C60.2 C61.2 C62.2 U2.5(Vs-) U2.10(Vs-) U2.15(Vs-) U2.23(Vs-) U2.24(Vs-) U2.28(Vs-) U2.29(Vs-) U2.33(Vs-) U2.34(Vs-) U2.38(Vs-) ; port -0V23, sheet BOA1/-0V23, sheet BOA2/-0V23, sheet BOA3/-0V23, sheet BOA4/-0V23
AIN_N1: port AIN_N1, sheet BOA1/AIN_N
AIN_N2: port AIN_N2, sheet BOA2/AIN_N
AIN_N3: port AIN_N3, sheet BOA3/AIN_N
AIN_N4: port AIN_N4, sheet BOA4/AIN_N
AIN_P1: port AIN_P1, sheet BOA1/AIN_P
AIN_P2: port AIN_P2, sheet BOA2/AIN_P
AIN_P3: port AIN_P3, sheet BOA3/AIN_P
AIN_P4: port AIN_P4, sheet BOA4/AIN_P
AOUT_N1: port AOUT_N1, sheet CDMF1/OUT_N
AOUT_N2: port AOUT_N2, sheet CDMF2/OUT_N
AOUT_N3: port AOUT_N3, sheet CDMF3/OUT_N
AOUT_N4: port AOUT_N4, sheet CDMF4/OUT_N
AOUT_P1: port AOUT_P1, sheet CDMF1/OUT_P
AOUT_P2: port AOUT_P2, sheet CDMF2/OUT_P
AOUT_P3: port AOUT_P3, sheet CDMF3/OUT_P
AOUT_P4: port AOUT_P4, sheet CDMF4/OUT_P
NetC7_1: C7.1 R9.2 R11.1 U2.2(IN+)
NetC7_2: C7.2 R9.1 U2.37(OUT-) ; sheet CDMF1/IN_N
NetC9_1: C9.1 R10.2 R12.1 U2.12(IN+)
NetC9_2: C9.2 R10.1 U2.27(OUT-) ; sheet CDMF3/IN_N
NetC12_1: C12.1 R13.1 R15.2 U2.3(IN-)
NetC12_2: C12.2 R15.1 U2.36(OUT+) ; sheet CDMF1/IN_P
NetC13_1: C13.1 R14.1 R17.2 U2.13(IN-)
NetC13_2: C13.2 R17.1 U2.26(OUT+) ; sheet CDMF3/IN_P
NetC14_1: C14.1 R19.2 R32.1 U2.7(IN+)
NetC14_2: C14.2 R19.1 U2.32(OUT-) ; sheet CDMF2/IN_N
NetC15_1: C15.1 R20.2 R33.1 U2.17(IN+)
NetC15_2: C15.2 R20.1 U2.22(OUT-) ; sheet CDMF4/IN_N
NetC16_1: C16.1 R34.1 R36.2 U2.8(IN-)
NetC16_2: C16.2 R36.1 U2.31(OUT+) ; sheet CDMF2/IN_P
NetC17_1: C17.1 R35.1 R37.2 U2.18(IN-)
NetC17_2: C17.2 R37.1 U2.21(OUT+) ; sheet CDMF4/IN_P
NetR11_2: R11.2 ; sheet BOA1/Buffer_P
NetR12_2: R12.2 ; sheet BOA3/Buffer_P
NetR13_2: R13.2 ; sheet BOA1/Buffer_N
NetR14_2: R14.2 ; sheet BOA3/Buffer_N
NetR32_2: R32.2 ; sheet BOA2/Buffer_P
NetR33_2: R33.2 ; sheet BOA4/Buffer_P
NetR34_2: R34.2 ; sheet BOA2/Buffer_N
NetR35_2: R35.2 ; sheet BOA4/Buffer_N

Not connected (* = marked no-connect by the designer): U2 1(PD1)* 6(PD2)* 11(PD3)* 16(PD4)*

### Channels
AF1: designators end in A; ports -0V23=Vneg_1 AIN_N1=AIN_N1 AIN_N2=AIN_N2 AIN_N3=AIN_N3 AIN_N4=AIN_N4 AIN_P1=AIN_P1 AIN_P2=AIN_P2 AIN_P3=AIN_P3 AIN_P4=AIN_P4 AOUT_N1=AIN_ADC_N1 AOUT_N2=AIN_ADC_N2 AOUT_N3=AIN_ADC_N3 AOUT_N4=AIN_ADC_N4 AOUT_P1=AIN_ADC_P1 AOUT_P2=AIN_ADC_P2 AOUT_P3=AIN_ADC_P3 AOUT_P4=AIN_ADC_P4
AF2: designators end in B; ports -0V23=Vneg_1 AIN_N1=AIN_N5 AIN_N2=AIN_N6 AIN_N3=AIN_N7 AIN_N4=AIN_N8 AIN_P1=AIN_P5 AIN_P2=AIN_P6 AIN_P3=AIN_P7 AIN_P4=AIN_P8 AOUT_N1=AIN_ADC_N5 AOUT_N2=AIN_ADC_N6 AOUT_N3=AIN_ADC_N7 AOUT_N4=AIN_ADC_N8 AOUT_P1=AIN_ADC_P5 AOUT_P2=AIN_ADC_P6 AOUT_P3=AIN_ADC_P7 AOUT_P4=AIN_ADC_P8
AF3: designators end in C; ports -0V23=Vneg_2 AIN_N1=AIN_N9 AIN_N2=AIN_N10 AIN_N3=AIN_N11 AIN_N4=AIN_N12 AIN_P1=AIN_P9 AIN_P2=AIN_P10 AIN_P3=AIN_P11 AIN_P4=AIN_P12 AOUT_N1=AIN_ADC_N9 AOUT_N2=AIN_ADC_N10 AOUT_N3=AIN_ADC_N11 AOUT_N4=AIN_ADC_N12 AOUT_P1=AIN_ADC_P9 AOUT_P2=AIN_ADC_P10 AOUT_P3=AIN_ADC_P11 AOUT_P4=AIN_ADC_P12
AF4: designators end in D; ports -0V23=Vneg_2 AIN_N1=AIN_N13 AIN_N2=AIN_N14 AIN_N3=AIN_N15 AIN_N4=AIN_N16 AIN_P1=AIN_P13 AIN_P2=AIN_P14 AIN_P3=AIN_P15 AIN_P4=AIN_P16 AOUT_N1=AIN_ADC_N13 AOUT_N2=AIN_ADC_N14 AOUT_N3=AIN_ADC_N15 AOUT_N4=AIN_ADC_N16 AOUT_P1=AIN_ADC_P13 AOUT_P2=AIN_ADC_P14 AOUT_P3=AIN_ADC_P15 AOUT_P4=AIN_ADC_P16
AF5: designators end in E; ports -0V23=Vneg_3 AIN_N1=AIN_N17 AIN_N2=AIN_N18 AIN_N3=AIN_N19 AIN_N4=AIN_N20 AIN_P1=AIN_P17 AIN_P2=AIN_P18 AIN_P3=AIN_P19 AIN_P4=AIN_P20 AOUT_N1=AIN_ADC_N17 AOUT_N2=AIN_ADC_N18 AOUT_N3=AIN_ADC_N19 AOUT_N4=AIN_ADC_N20 AOUT_P1=AIN_ADC_P17 AOUT_P2=AIN_ADC_P18 AOUT_P3=AIN_ADC_P19 AOUT_P4=AIN_ADC_P20
AF6: designators end in F; ports -0V23=Vneg_3 AIN_N1=AIN_N21 AIN_N2=AIN_N22 AIN_N3=AIN_N23 AIN_N4=AIN_N24 AIN_P1=AIN_P21 AIN_P2=AIN_P22 AIN_P3=AIN_P23 AIN_P4=AIN_P24 AOUT_N1=AIN_ADC_N21 AOUT_N2=AIN_ADC_N22 AOUT_N3=AIN_ADC_N23 AOUT_N4=AIN_ADC_N24 AOUT_P1=AIN_ADC_P21 AOUT_P2=AIN_ADC_P22 AOUT_P3=AIN_ADC_P23 AOUT_P4=AIN_ADC_P24

### Notes on the sheet
- Analog Input
- 0V to +5V
- Analog Output Range to ADC
- 0V to +3.3V
- Title
- Revision:
- Design Engineer:
- Date:
- Project:
- Sheet
- of

### Library data of the parts
C7 C9 C12-C17 = UZgen_C_0402_56pF_50V_NP0: Generic capacitor; Manufacturer: UZgen; Voltage: 50V; Tolerance: 10 %; Created from: UZgenTool; Manufacturer Part Number: UZgen_C_0402_56pF_50V_NP0; PartID: 5655; Created On: 13.12.2024 11:08:44; Value: 56 pF; Device Package: 0402; Technology: NP0; Mounting Type: SMD; Last Updated: 13.12.2024 11:08:44
C47 C48 C53-C62 = UZgen_C_0402_100nF_50V_X7R: Generic capacitor; Manufacturer: UZgen; Voltage: 50V; Tolerance: 10 %; Created from: UZgenTool; Manufacturer Part Number: UZgen_C_0402_100nF_50V_X7R; PartID: 3431; Created On: 02.08.2024 11:17:51; Value: 100 nF; Device Package: 0402; Technology: X7R; Mounting Type: SMD; Last Updated: 02.08.2024 11:17:51
R9 R10 R15 R17 R19 R20 R36 R37 = RT0402BRD076K65L: 62.5mW Thin Film Resistor ±25ppm/℃ ±0.1% 6.65kΩ 0402 Chip Resistor - Surface Mount ROHS; Manufacturer: YAGEO; Created from: AGeiger; Manufacturer Part Number: RT0402BRD076K65L; PartID: 360; Created On: 18.11.2024 08:40:15; ComponentLink1Description: Datasheet; ComponentLink1URL: https://www.lcsc.com/datasheet/lcsc_datasheet_2304140030_YAGEO-RT0402BRD076K65L_C728562.pdf; Component Type: SMD resistor; Device Package: 0402; Last Updated: 18.11.2024 08:40:15; Mounting Type: SMD; Supplier 1: LCSC; Supplier Part Number 1: C728562; Type: Resistor; Value: 6k65; Live Cycle Status: 1; LCSC Part Number: C728562
R11-R14 R32-R35 = RT0402BRD0710KL: 62.5mW Thin Film Resistor 50V ±25ppm/℃ ±0.1% 10kΩ 0402 Chip Resistor - Surface Mount ROHS; Manufacturer: YAGEO; Created from: AGeiger; Manufacturer Part Number: RT0402BRD0710KL; PartID: 359; Created On: 18.11.2024 08:40:15; ComponentLink1Description: Datasheet; ComponentLink1URL: https://www.lcsc.com/datasheet/lcsc_datasheet_2304140030_YAGEO-RT0402BRD0710KL_C190095.pdf; Component Type: SMD resistor; Device Package: 0402; Last Updated: 18.11.2024 08:40:15; Mounting Type: SMD; Supplier 1: LCSC; Supplier Part Number 1: C190095; Type: Resistor; Value: 10k; Live Cycle Status: 1; LCSC Part Number: C190095
U2 = THS4524IDBTR: Differential Amplifier, Very Low Power, Negative Rail Input; Manufacturer: Texas Instruments; Channels: 4; GBP: 145 MHz; CMRR: 80 - 102 dB; Value: Rail-to-Rail; Created from: MGremer; Manufacturer Part Number: THS4524IDBTR; PartID: 2; Created On: 15.01.2021 11:55:32; ComponentLink1Description: Datasheet; ComponentLink1URL: https://www.ti.com/lit/ds/symlink/ths4524.pdf?HQS=dis-mous-null-mousermode-dsf-pf-null-wwe&ts=1610629243115&ref_url=https%253A%252F%252Fwww.mouser.de%252F; Component Type: Differential Amplifier; Device Package: TSSOP-38; Last Updated: 15.11.2024 08:41:37; Mounting Type: SMD; Operating Temperature: -40 to +85 °C; Supplier 1: Mouser; Supplier Part Number 1: 595-THS4524IDBTR; Supplier 2: LCSC; Supplier Part Number 2: C2057434; Type: Differential Amplifiers; Live Cycle Status: 1; LCSC Part Number: C2057434; Stock number: not stored

## Sheet BufferOpAmp.SchDoc
size A4; Author: Andreas Geiger; CompanyName: Technische Hochschule Nürnberg Georg Simon Ohm; Organization: UltraZohm; Address1: Kesslerplatz 12; Address2: 90489 Nürnberg; Address3: GERMANY; DocumentNumber: 6; SheetNumber: 6; SheetTotal: 12; Website: www.ultrazohm.com
Used 24 times, as channels AF1/BOA1, AF1/BOA2, AF1/BOA3, AF1/BOA4, AF2/BOA1, AF2/BOA2, AF2/BOA3, AF2/BOA4, AF3/BOA1, AF3/BOA2, AF3/BOA3, AF3/BOA4, AF4/BOA1, AF4/BOA2, AF4/BOA3, AF4/BOA4, AF5/BOA1, AF5/BOA2, AF5/BOA3, AF5/BOA4, AF6/BOA1, AF6/BOA2, AF6/BOA3, AF6/BOA4. Parts and nets are listed once, with the designators drawn on the sheet.
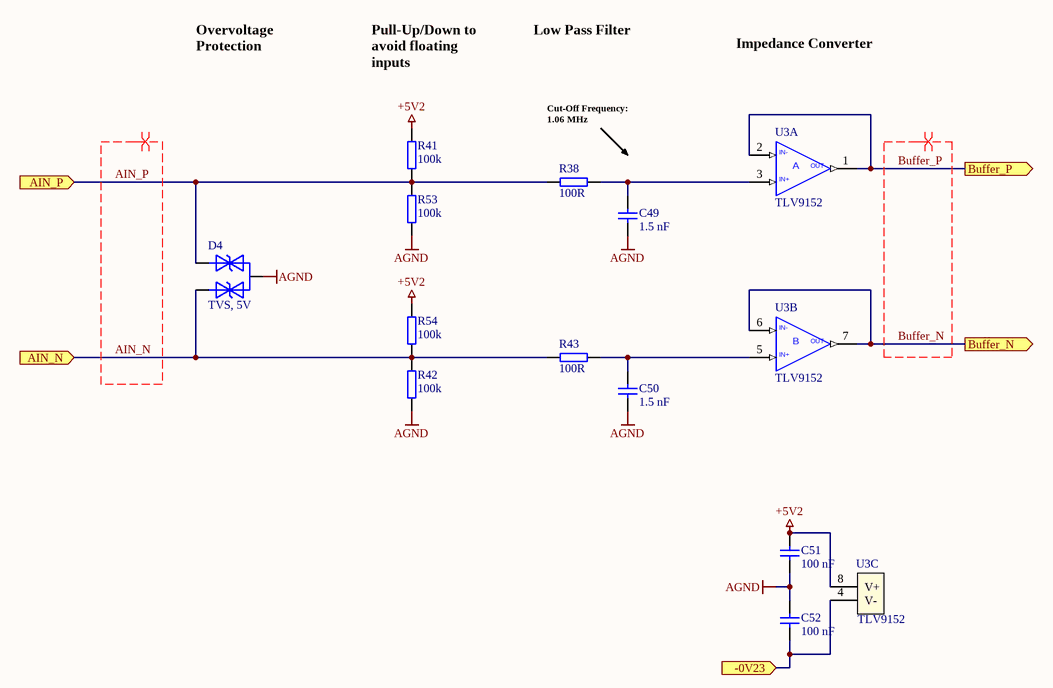
[diagram p4: BufferOpAmp.SchDoc]

### Parts
C49  1.5 nF  [C_0402_TE]
C50  1.5 nF  [C_0402_TE]
C51  100 nF  [C_0402_TE]
C52  100 nF  [C_0402_TE]
D4  TVS, 5V  [SOT-23-3]
R38  100R  [R_0402_TE]
R41  100k  [R_0402_TE]
R42  100k  [R_0402_TE]
R43  100R  [R_0402_TE]
R53  100k  [R_0402_TE]
R54  100k  [R_0402_TE]
U3  TLV9152  [MSOP-8_IPC_B]  (parts A,B,C of 3)

### Ports
-0V23 (in), AIN_N (in), AIN_P (in), Buffer_N (out), Buffer_P (out)

### Nets
+5V2: C51.1 R41.2 R54.2 U3.8(V+)
AGND: C49.1 C50.1 C51.2 C52.1 D4.3(A) R42.1 R53.1
-0V23: C52.2 U3.4(V-) ; port -0V23
AIN_N: D4.2(K2) R42.2 R43.1 R54.1 ; port AIN_N
AIN_P: D4.1(K1) R38.1 R41.1 R53.2 ; port AIN_P
Buffer_N: U3.6(-IN_B) U3.7(OUT_B) ; port Buffer_N
Buffer_P: U3.1(OUT_A) U3.2(-IN_A) ; port Buffer_P
NetC49_2: C49.2 R38.2 U3.3(+IN_A)
NetC50_2: C50.2 R43.2 U3.5(+IN_B)

### Channels
AF1/BOA1: designators end in A; ports -0V23=Vneg_1 AIN_N=AIN_N1 AIN_P=AIN_P1 Buffer_N=Buffer_N Buffer_P=Buffer_P
AF1/BOA2: designators end in B; ports -0V23=Vneg_1 AIN_N=AIN_N2 AIN_P=AIN_P2 Buffer_N=Buffer_N Buffer_P=Buffer_P
AF1/BOA3: designators end in C; ports -0V23=Vneg_1 AIN_N=AIN_N3 AIN_P=AIN_P3 Buffer_N=Buffer_N Buffer_P=Buffer_P
AF1/BOA4: designators end in D; ports -0V23=Vneg_1 AIN_N=AIN_N4 AIN_P=AIN_P4 Buffer_N=Buffer_N Buffer_P=Buffer_P
AF2/BOA1: designators end in E; ports -0V23=Vneg_1 AIN_N=AIN_N5 AIN_P=AIN_P5 Buffer_N=Buffer_N Buffer_P=Buffer_P
AF2/BOA2: designators end in F; ports -0V23=Vneg_1 AIN_N=AIN_N6 AIN_P=AIN_P6 Buffer_N=Buffer_N Buffer_P=Buffer_P
AF2/BOA3: designators end in G; ports -0V23=Vneg_1 AIN_N=AIN_N7 AIN_P=AIN_P7 Buffer_N=Buffer_N Buffer_P=Buffer_P
AF2/BOA4: designators end in H; ports -0V23=Vneg_1 AIN_N=AIN_N8 AIN_P=AIN_P8 Buffer_N=Buffer_N Buffer_P=Buffer_P
AF3/BOA1: designators end in I; ports -0V23=Vneg_2 AIN_N=AIN_N9 AIN_P=AIN_P9 Buffer_N=Buffer_N Buffer_P=Buffer_P
AF3/BOA2: designators end in J; ports -0V23=Vneg_2 AIN_N=AIN_N10 AIN_P=AIN_P10 Buffer_N=Buffer_N Buffer_P=Buffer_P
AF3/BOA3: designators end in K; ports -0V23=Vneg_2 AIN_N=AIN_N11 AIN_P=AIN_P11 Buffer_N=Buffer_N Buffer_P=Buffer_P
AF3/BOA4: designators end in L; ports -0V23=Vneg_2 AIN_N=AIN_N12 AIN_P=AIN_P12 Buffer_N=Buffer_N Buffer_P=Buffer_P
AF4/BOA1: designators end in M; ports -0V23=Vneg_2 AIN_N=AIN_N13 AIN_P=AIN_P13 Buffer_N=Buffer_N Buffer_P=Buffer_P
AF4/BOA2: designators end in N; ports -0V23=Vneg_2 AIN_N=AIN_N14 AIN_P=AIN_P14 Buffer_N=Buffer_N Buffer_P=Buffer_P
AF4/BOA3: designators end in O; ports -0V23=Vneg_2 AIN_N=AIN_N15 AIN_P=AIN_P15 Buffer_N=Buffer_N Buffer_P=Buffer_P
AF4/BOA4: designators end in P; ports -0V23=Vneg_2 AIN_N=AIN_N16 AIN_P=AIN_P16 Buffer_N=Buffer_N Buffer_P=Buffer_P
AF5/BOA1: designators end in Q; ports -0V23=Vneg_3 AIN_N=AIN_N17 AIN_P=AIN_P17 Buffer_N=Buffer_N Buffer_P=Buffer_P
AF5/BOA2: designators end in R; ports -0V23=Vneg_3 AIN_N=AIN_N18 AIN_P=AIN_P18 Buffer_N=Buffer_N Buffer_P=Buffer_P
AF5/BOA3: designators end in S; ports -0V23=Vneg_3 AIN_N=AIN_N19 AIN_P=AIN_P19 Buffer_N=Buffer_N Buffer_P=Buffer_P
AF5/BOA4: designators end in T; ports -0V23=Vneg_3 AIN_N=AIN_N20 AIN_P=AIN_P20 Buffer_N=Buffer_N Buffer_P=Buffer_P
AF6/BOA1: designators end in U; ports -0V23=Vneg_3 AIN_N=AIN_N21 AIN_P=AIN_P21 Buffer_N=Buffer_N Buffer_P=Buffer_P
AF6/BOA2: designators end in V; ports -0V23=Vneg_3 AIN_N=AIN_N22 AIN_P=AIN_P22 Buffer_N=Buffer_N Buffer_P=Buffer_P
AF6/BOA3: designators end in W; ports -0V23=Vneg_3 AIN_N=AIN_N23 AIN_P=AIN_P23 Buffer_N=Buffer_N Buffer_P=Buffer_P
AF6/BOA4: designators end in X; ports -0V23=Vneg_3 AIN_N=AIN_N24 AIN_P=AIN_P24 Buffer_N=Buffer_N Buffer_P=Buffer_P

### Layout directives
differential pair: AIN_N, AIN_P, Buffer_N, Buffer_P

### Notes on the sheet
- Overvoltage Protection
- Pull-Up/Down to avoid floating inputs
- Low Pass Filter
- Impedance Converter
- (near R38) Cut-Off Frequency:
  1.06 MHz
- Title
- Revision:
- Design Engineer:
- Date:
- Project:
- Sheet
- of
- (in symbol TLV9152IDGKR, part A) IN-; OUT; A; IN+
- (in symbol TLV9152IDGKR, part B) IN-; OUT; B; IN+

### Library data of the parts
C49 C50 = UZgen_C_0402_1.5nF_50V_NP0: Generic capacitor; Manufacturer: UZgen; Voltage: 50V; Tolerance: 10 %; Created from: UZgenTool; Manufacturer Part Number: UZgen_C_0402_1.5nF_50V_NP0; PartID: 5689; Created On: 13.12.2024 11:08:45; Value: 1.5 nF; Device Package: 0402; Technology: NP0; Mounting Type: SMD; Last Updated: 13.12.2024 11:08:45
C51 C52 = UZgen_C_0402_100nF_50V_X7R: as C47 on sheet Analog_Frontend_OpAmp; Manufacturer Part Number: UZgen_C_0402_100nF_50V_X7R; PartID: 3431; Created On: 02.08.2024 11:17:51; Value: 100 nF; Device Package: 0402; Technology: X7R; Mounting Type: SMD; Last Updated: 02.08.2024 11:17:51
D4 = SMC05: 2-Line Bi-directional TVS Diode Array; Manufacturer Part Number: SMC05; Manufacturer: Leditech; Type: TVS-Diode; Peak Impuls Current: 18 A; Power Dissipation: 300 W; Created from: AGeiger; PartID: 9; Created On: 30.08.2022 08:49:06; ComponentLink1Description: Datasheet; ComponentLink1URL: https://datasheet.lcsc.com/lcsc/1912111437_Leiditech-SMC05_C384879.pdf; Component Type: TVS Diode, ESD; Device Package: SOT-23-3; Last Updated: 30.08.2022 08:49:06; Mounting Type: SMD; Operating Temperature: -55 - 125°C; Series: SMC; Supplier 1: LCSC; Supplier Part Number 1: C384879; Value: TVS, 5V; Live Cycle Status: 1; LCSC Part Number: C384879
R38 R43 = UZgen_R_0402_100R: Generic resistor; Manufacturer: UZgen; Tolerance: 1 %; Created from: UZgenTool; Manufacturer Part Number: UZgen_R_0402_100R; PartID: 53; Created On: 02.07.2024 17:29:45; Value: 100R; Device Package: 0402; Mounting Type: SMD; Last Updated: 02.07.2024 17:29:45
R41 R42 R53 R54 = UZgen_R_0402_100k: Generic resistor; Manufacturer: UZgen; Tolerance: 1 %; Created from: UZgenTool; Manufacturer Part Number: UZgen_R_0402_100k; PartID: 125; Created On: 02.07.2024 17:29:47; Value: 100k; Device Package: 0402; Mounting Type: SMD; Last Updated: 02.07.2024 17:29:47
U3 = TLV9152IDGKR: Operationsverstärker Dual, 16-V, 4.5-MHz, low-power operational amplifier 8-VSSOP -40 to 125; Manufacturer: Texas Instruments; Channels: 2; GBP: 4.5 MHz; CMRR: 120 dB; Created from: AGeiger; Manufacturer Part Number: TLV9152IDGKR; PartID: 36; Created On: 15.11.2024 09:00:35; ComponentLink1Description: Datasheet; ComponentLink1URL: https://www.ti.com/lit/gpn/tlv9152; Component Type: Operational Amplifier; Device Package: MSOP-8; Last Updated: 15.11.2024 09:00:35; Mounting Type: SMD; Operating Temperature: -40 to +125 °C; Series: TLV915x; Supplier 1: Mouser; Supplier Part Number 1: 595-TLV9152IDGKR; Supplier 2: LCSC; Supplier Part Number 2: C4366107; Type: OpAmp; Value: TLV9152; Live Cycle Status: 1; LCSC Part Number: C4366107

## Sheet CM_DM_Filter.SchDoc
size A4; Author: Andreas Geiger; CompanyName: Technische Hochschule Nürnberg Georg Simon Ohm; Organization: UltraZohm; Address1: Kesslerplatz 12; Address2: 90489 Nürnberg; Address3: GERMANY; DocumentNumber: 7; SheetNumber: 7; SheetTotal: 12; Website: www.ultrazohm.com
Used 24 times, as channels AF1/CDMF1, AF1/CDMF2, AF1/CDMF3, AF1/CDMF4, AF2/CDMF1, AF2/CDMF2, AF2/CDMF3, AF2/CDMF4, AF3/CDMF1, AF3/CDMF2, AF3/CDMF3, AF3/CDMF4, AF4/CDMF1, AF4/CDMF2, AF4/CDMF3, AF4/CDMF4, AF5/CDMF1, AF5/CDMF2, AF5/CDMF3, AF5/CDMF4, AF6/CDMF1, AF6/CDMF2, AF6/CDMF3, AF6/CDMF4. Parts and nets are listed once, with the designators drawn on the sheet.
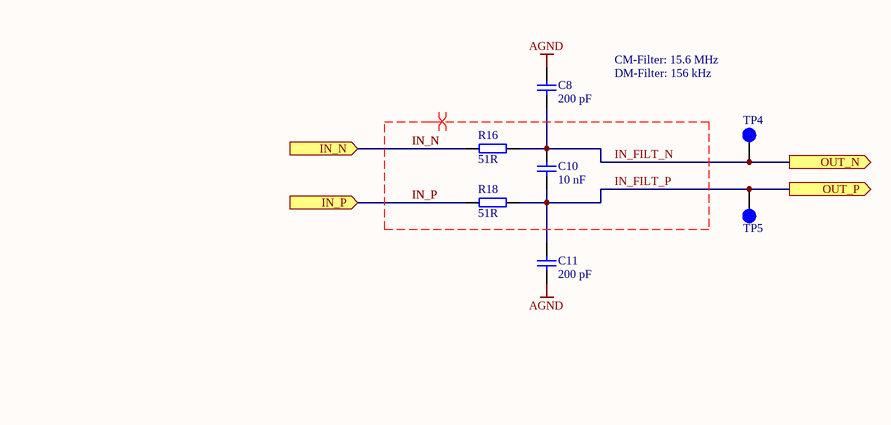
[diagram p5: CM_DM_Filter.SchDoc]

### Parts
C8  200 pF  [C_0402_TE]
C10  10 nF  [C_0402_TE]
C11  200 pF  [C_0402_TE]
R16  51R  [R_0402_TE]
R18  51R  [R_0402_TE]
TP4  Testpoint 1mm  [TP_1mm]  (value not drawn)  (no BOM)
TP5  Testpoint 1mm  [TP_1mm]  (value not drawn)  (no BOM)

### Ports
IN_N (in), IN_P (in), OUT_N (out), OUT_P (out)

### Nets
AGND: C8.1 C11.2
IN_FILT_N: C8.2 C10.1 R16.2 TP4.1 ; port OUT_N
IN_FILT_P: C10.2 C11.1 R18.2 TP5.1 ; port OUT_P
IN_N: R16.1 ; port IN_N
IN_P: R18.1 ; port IN_P

### Channels
AF1/CDMF1: designators end in A; ports IN_N=IN_N IN_P=IN_P OUT_N=AIN_ADC_N1 OUT_P=AIN_ADC_P1
AF1/CDMF2: designators end in B; ports IN_N=IN_N IN_P=IN_P OUT_N=AIN_ADC_N2 OUT_P=AIN_ADC_P2
AF1/CDMF3: designators end in C; ports IN_N=IN_N IN_P=IN_P OUT_N=AIN_ADC_N3 OUT_P=AIN_ADC_P3
AF1/CDMF4: designators end in D; ports IN_N=IN_N IN_P=IN_P OUT_N=AIN_ADC_N4 OUT_P=AIN_ADC_P4
AF2/CDMF1: designators end in E; ports IN_N=IN_N IN_P=IN_P OUT_N=AIN_ADC_N5 OUT_P=AIN_ADC_P5
AF2/CDMF2: designators end in F; ports IN_N=IN_N IN_P=IN_P OUT_N=AIN_ADC_N6 OUT_P=AIN_ADC_P6
AF2/CDMF3: designators end in G; ports IN_N=IN_N IN_P=IN_P OUT_N=AIN_ADC_N7 OUT_P=AIN_ADC_P7
AF2/CDMF4: designators end in H; ports IN_N=IN_N IN_P=IN_P OUT_N=AIN_ADC_N8 OUT_P=AIN_ADC_P8
AF3/CDMF1: designators end in I; ports IN_N=IN_N IN_P=IN_P OUT_N=AIN_ADC_N9 OUT_P=AIN_ADC_P9
AF3/CDMF2: designators end in J; ports IN_N=IN_N IN_P=IN_P OUT_N=AIN_ADC_N10 OUT_P=AIN_ADC_P10
AF3/CDMF3: designators end in K; ports IN_N=IN_N IN_P=IN_P OUT_N=AIN_ADC_N11 OUT_P=AIN_ADC_P11
AF3/CDMF4: designators end in L; ports IN_N=IN_N IN_P=IN_P OUT_N=AIN_ADC_N12 OUT_P=AIN_ADC_P12
AF4/CDMF1: designators end in M; ports IN_N=IN_N IN_P=IN_P OUT_N=AIN_ADC_N13 OUT_P=AIN_ADC_P13
AF4/CDMF2: designators end in N; ports IN_N=IN_N IN_P=IN_P OUT_N=AIN_ADC_N14 OUT_P=AIN_ADC_P14
AF4/CDMF3: designators end in O; ports IN_N=IN_N IN_P=IN_P OUT_N=AIN_ADC_N15 OUT_P=AIN_ADC_P15
AF4/CDMF4: designators end in P; ports IN_N=IN_N IN_P=IN_P OUT_N=AIN_ADC_N16 OUT_P=AIN_ADC_P16
AF5/CDMF1: designators end in Q; ports IN_N=IN_N IN_P=IN_P OUT_N=AIN_ADC_N17 OUT_P=AIN_ADC_P17
AF5/CDMF2: designators end in R; ports IN_N=IN_N IN_P=IN_P OUT_N=AIN_ADC_N18 OUT_P=AIN_ADC_P18
AF5/CDMF3: designators end in S; ports IN_N=IN_N IN_P=IN_P OUT_N=AIN_ADC_N19 OUT_P=AIN_ADC_P19
AF5/CDMF4: designators end in T; ports IN_N=IN_N IN_P=IN_P OUT_N=AIN_ADC_N20 OUT_P=AIN_ADC_P20
AF6/CDMF1: designators end in U; ports IN_N=IN_N IN_P=IN_P OUT_N=AIN_ADC_N21 OUT_P=AIN_ADC_P21
AF6/CDMF2: designators end in V; ports IN_N=IN_N IN_P=IN_P OUT_N=AIN_ADC_N22 OUT_P=AIN_ADC_P22
AF6/CDMF3: designators end in W; ports IN_N=IN_N IN_P=IN_P OUT_N=AIN_ADC_N23 OUT_P=AIN_ADC_P23
AF6/CDMF4: designators end in X; ports IN_N=IN_N IN_P=IN_P OUT_N=AIN_ADC_N24 OUT_P=AIN_ADC_P24

### Layout directives
differential pair: IN_FILT_N, IN_FILT_P, IN_N, IN_P

### Notes on the sheet
- CM-Filter: 15.6 MHz
- DM-Filter: 156 kHz
- Title
- Revision:
- Design Engineer:
- Date:
- Project:
- Sheet
- of

### Library data of the parts
C8 C11 = UZgen_C_0402_200pF_50V_NP0: Generic capacitor; Manufacturer: UZgen; Voltage: 50V; Tolerance: 10 %; Created from: UZgenTool; Manufacturer Part Number: UZgen_C_0402_200pF_50V_NP0; PartID: 5668; Created On: 13.12.2024 11:08:45; Value: 200 pF; Device Package: 0402; Technology: NP0; Mounting Type: SMD; Last Updated: 13.12.2024 11:08:45
C10 = UZgen_C_0402_10nF_50V_NP0: Generic capacitor; Manufacturer: UZgen; Voltage: 50V; Tolerance: 10 %; Created from: UZgenTool; Manufacturer Part Number: UZgen_C_0402_10nF_50V_NP0; PartID: 5709; Created On: 13.12.2024 11:08:46; Value: 10 nF; Device Package: 0402; Technology: NP0; Mounting Type: SMD; Last Updated: 13.12.2024 11:08:46
R16 R18 = UZgen_R_0402_51R: Generic resistor; Manufacturer: UZgen; Tolerance: 1 %; Created from: UZgenTool; Manufacturer Part Number: UZgen_R_0402_51R; PartID: 46; Created On: 02.07.2024 17:29:45; Value: 51R; Device Package: 0402; Mounting Type: SMD; Last Updated: 02.07.2024 17:29:45
TP4 TP5 = Testpoint_1mm: as TP3 on sheet CarrierConnector; Created: 2018_06_25_AGeiger; Value: Testpoint 1mm; Manufacturer Part Number: Testpoint_1mm; PartID: 9; Created On: 20.09.2022 13:14:57; Component Type: Testpoint; Last Updated: 14.08.2025 11:47:07; Supplier 1: NULL; Supplier Part Number 1: NULL; Type: Testpoint; Live Cycle Status: 1

## Sheet Block_Diagram.SchDoc
size A4; Author: Andreas Geiger; CompanyName: Technische Hochschule Nürnberg Georg Simon Ohm; Organization: UltraZohm; Address1: Kesslerplatz 12; Address2: 90489 Nürnberg; Address3: GERMANY; DocumentNumber: 1; SheetNumber: 1; SheetTotal: 12; Website: www.ultrazohm.com
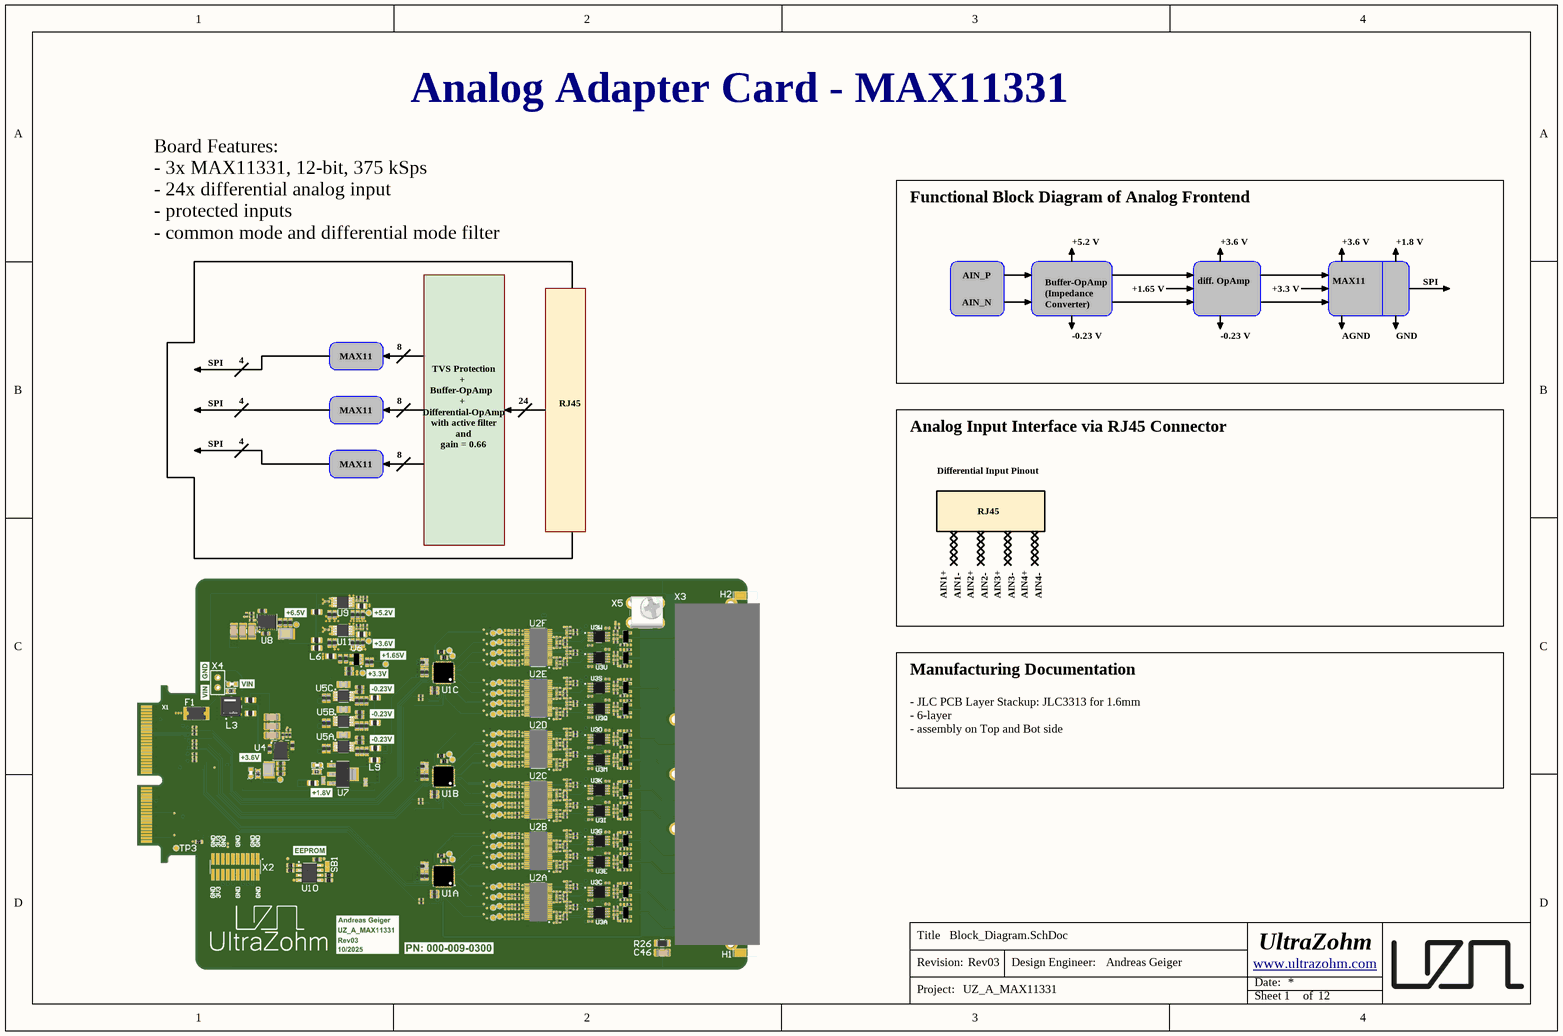
[diagram p6: Block_Diagram.SchDoc]

### Notes on the sheet
- Analog Adapter Card - MAX11331
- Functional Block Diagram of Analog Frontend
- +5.2 V
- +3.6 V
- +1.8 V
- AIN_P
- AIN_N
- Buffer-OpAmp
  (Impedance Converter)
- +1.65 V
- diff. OpAmp
- +3.3 V
- MAX11
- SPI
- Board Features:
  - 3x MAX11331, 12-bit, 375 kSps
  - 24x differential analog input
  - protected inputs
  - common mode and differential mode filter
- 4
- 8
- -0.23 V
- AGND
- GND
- 24
- RJ45
- Analog Input Interface via RJ45 Connector
- Differential Input Pinout
- TVS Protection
  +
  Buffer-OpAmp
  +
  Differential-OpAmp
  with active filter and
  gain = 0.66
- AIN1+
- AIN1-
- AIN2+
- AIN2-
- AIN3+
- AIN3-
- AIN4+
- AIN4-
- Manufacturing Documentation
- - JLC PCB Layer Stackup: JLC3313 for 1.6mm
  - 6-layer
  - assembly on Top and Bot side
- Title
- Revision:
- Design Engineer:
- Date:
- Project:
- Sheet
- of